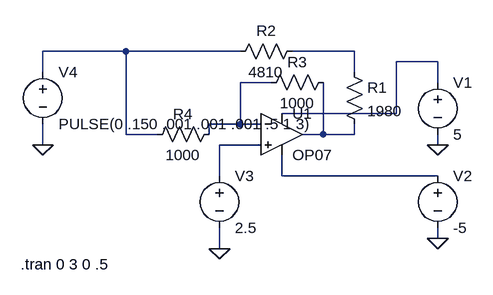
[diagram p0: schematic Draft1.asc]
Draft1.asc, the LTspice schematic file:
Version 4
SHEET 1 880 680
WIRE -128 0 -256 0
WIRE 48 0 -128 0
WIRE 224 0 128 0
WIRE 352 16 288 16
WIRE -256 32 -256 0
WIRE 224 32 224 0
WIRE 96 48 48 48
WIRE 352 48 352 16
WIRE 288 96 288 16
WIRE 288 96 112 96
WIRE 48 112 48 48
WIRE 48 112 0 112
WIRE 80 112 48 112
WIRE -128 128 -128 0
WIRE -80 128 -128 128
WIRE 0 128 0 112
WIRE 176 128 176 48
WIRE 176 128 144 128
WIRE 224 128 224 112
WIRE 224 128 176 128
WIRE -256 144 -256 112
WIRE 80 144 16 144
WIRE 352 144 352 128
WIRE 16 192 16 144
WIRE 112 192 112 160
WIRE 352 192 112 192
WIRE 352 288 352 272
WIRE 16 304 16 272
FLAG 352 144 0
FLAG 352 288 0
FLAG 16 304 0
FLAG -256 144 0
SYMBOL Opamps\\OP07 112 64 R0
SYMATTR InstName U1
SYMBOL res 208 16 R0
SYMATTR InstName R1
SYMATTR Value 1980
SYMBOL res 144 -16 R90
WINDOW 0 0 56 VBottom 2
WINDOW 3 32 56 VTop 2
SYMATTR InstName R2
SYMATTR Value 4810
SYMBOL res 192 32 R90
WINDOW 0 0 56 VBottom 2
WINDOW 3 32 56 VTop 2
SYMATTR InstName R3
SYMATTR Value 1000
SYMBOL res 16 112 R90
WINDOW 0 0 56 VBottom 2
WINDOW 3 32 56 VTop 2
SYMATTR InstName R4
SYMATTR Value 1000
SYMBOL voltage 352 32 R0
WINDOW 123 0 0 Left 2
WINDOW 39 0 0 Left 2
SYMATTR InstName V1
SYMATTR Value 5
SYMBOL voltage 352 176 R0
WINDOW 123 0 0 Left 2
WINDOW 39 0 0 Left 2
SYMATTR InstName V2
SYMATTR Value -5
SYMBOL voltage 16 176 R0
WINDOW 123 0 0 Left 2
WINDOW 39 0 0 Left 2
SYMATTR InstName V3
SYMATTR Value 2.5
SYMBOL voltage -256 16 R0
WINDOW 123 0 0 Left 2
WINDOW 39 0 0 Left 2
SYMATTR InstName V4
SYMATTR Value PULSE(0 .150 .001 .001 .001 .5 1 3)
TEXT -290 328 Left 2 !.tran 0 3 0 .5

The netlist it stands for:
* Draft1.asc
XU1 N006 N004 N003 N007 N005 LT1001  ; OP07, pins In+ In- V+ V- OUT
R1 N002 N005 1980
R2 N002 N001 4810
R3 N005 N004 1000
R4 N004 N001 1000
V1 N003 0 5
V2 N007 0 -5
V3 N006 0 2.5
V4 N001 0 PULSE(0 .150 .001 .001 .001 .5 1 3)
.tran 0 3 0 .5
.lib LTC.lib
.backanno
.end